# Altium schematic sheet Connectors.SchDoc
size A4; SheetNumber: 4; SheetTotal: 7
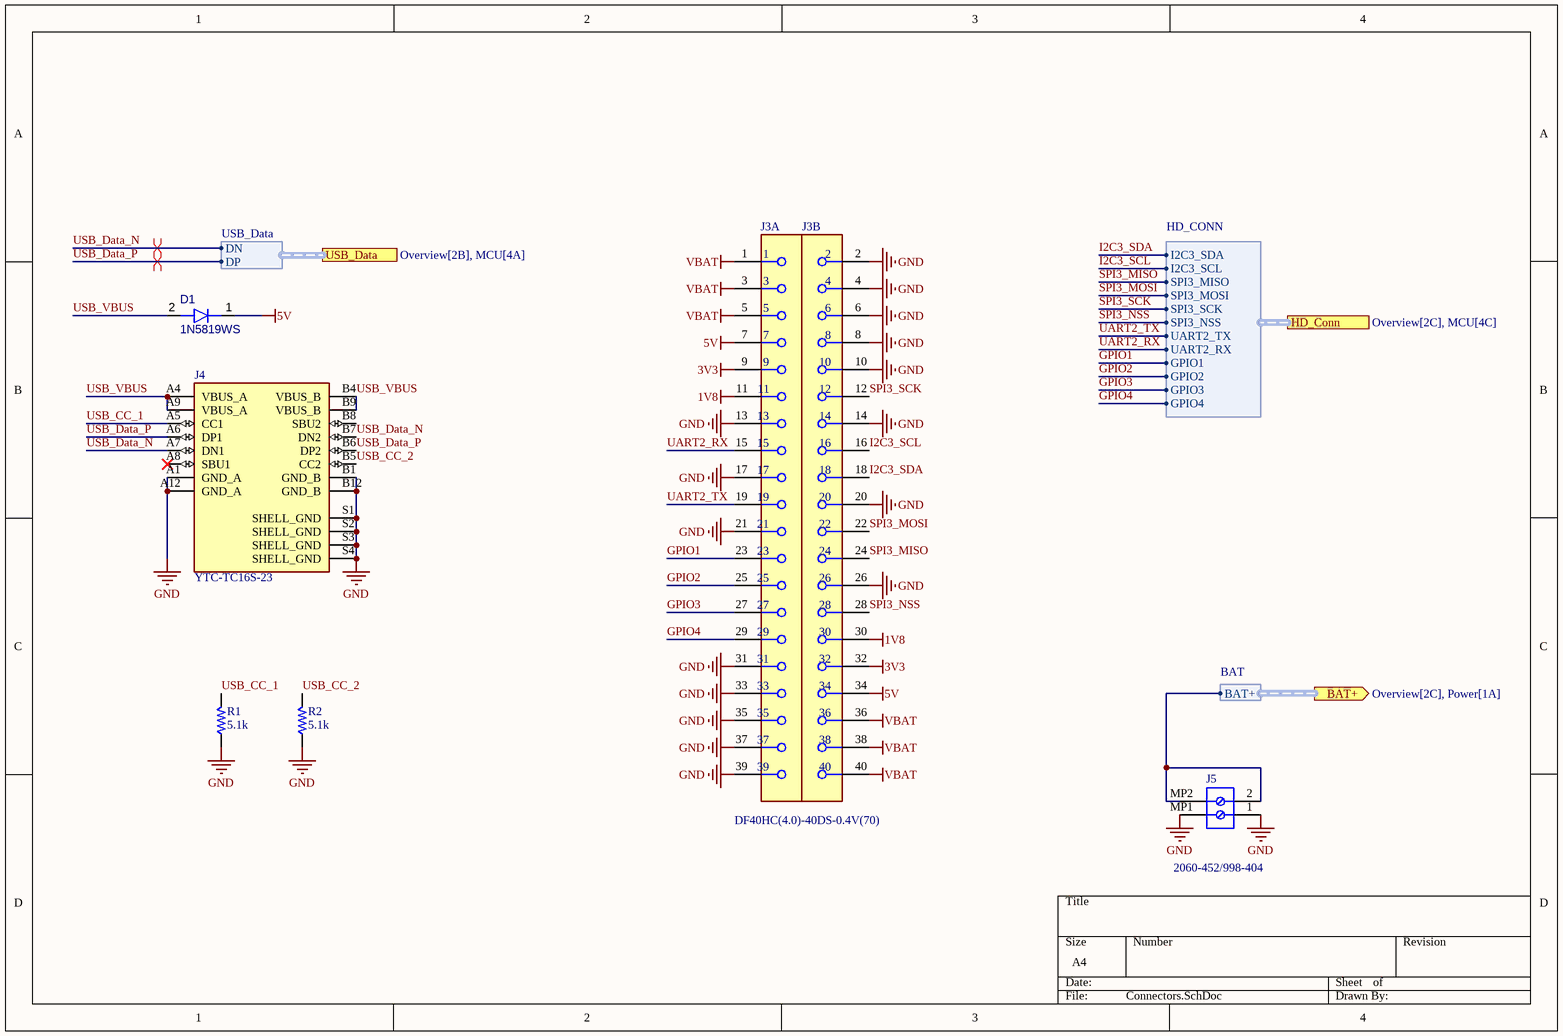
[diagram p0: Connectors.SchDoc]

## Parts
D1  1N5819WS  [FP-477-02-IPC_C]
J3  DF40HC(4.0)-40DS-0.4V(70)  [FP-DF40HC_4_0_-40DS-0_4V-MFG]  (parts A,B of 2)
J4  YTC-TC16S-23  [VALCON_CSP-USC16-TR]
J5  2060-452/998-404  [WAGO-2060-452_V]
R1  value 5.1k  [RES-0402]  (hidden comment: 0402WGF5101TCE)
R2  value 5.1k  [RES-0402]  (hidden comment: 0402WGF5101TCE)

## Ports
BAT+ (out, harness BAT, see Overview[2C], Power[1A]), HD_Conn (harness HD_CONN, see Overview[2C], MCU[4C]), USB_Data (harness USB_Data, see Overview[2B], MCU[4A])

## Harnesses
USB_Data: DP, DN
BAT: BAT+
HD_CONN: I2C3_SDA, I2C3_SCL, SPI3_MISO, SPI3_MOSI, SPI3_SCK, SPI3_NSS, UART2_TX, UART2_RX, GPIO1, GPIO2, GPIO3, GPIO4

## Nets
1V8: J3.11 J3.30
3V3: J3.9 J3.32
5V: D1.1(K) J3.7 J3.34
GND: J3.2 J3.4 J3.6 J3.8 J3.10 J3.13 J3.14 J3.17 J3.20 J3.21 J3.26 J3.31 J3.33 J3.35 J3.37 J3.39 J4.A1(GND_A) J4.A12(GND_A) J4.B1(GND_B) J4.B12(GND_B) J4.S1(SHELL_GND) J4.S2(SHELL_GND) J4.S3(SHELL_GND) J4.S4(SHELL_GND) J5.1 J5.MP1 R1.1 R2.1
VBAT: J3.1 J3.3 J3.5 J3.36 J3.38 J3.40
GPIO1: J3.23 ; port HD_Conn.GPIO1
GPIO2: J3.25 ; port HD_Conn.GPIO2
GPIO3: J3.27 ; port HD_Conn.GPIO3
GPIO4: J3.29 ; port HD_Conn.GPIO4
I2C3_SCL: J3.16 ; port HD_Conn.I2C3_SCL
I2C3_SDA: J3.18 ; port HD_Conn.I2C3_SDA
SPI3_MISO: J3.24 ; port HD_Conn.SPI3_MISO
SPI3_MOSI: J3.22 ; port HD_Conn.SPI3_MOSI
SPI3_NSS: J3.28 ; port HD_Conn.SPI3_NSS
SPI3_SCK: J3.12 ; port HD_Conn.SPI3_SCK
UART2_RX: J3.15 ; port HD_Conn.UART2_RX
UART2_TX: J3.19 ; port HD_Conn.UART2_TX
USB_CC_1: J4.A5(CC1) R1.2
USB_CC_2: J4.B5(CC2) R2.2
USB_Data_N: J4.A7(DN1) J4.B7(DN2) ; port USB_Data.DN
USB_Data_P: J4.A6(DP1) J4.B6(DP2) ; port USB_Data.DP
USB_VBUS: D1.2(A) J4.A4(VBUS_A) J4.A9(VBUS_A) J4.B4(VBUS_B) J4.B9(VBUS_B)
NetJ5_2: J5.2 J5.MP2 ; port BAT+.BAT+

Not connected (* = marked no-connect by the designer): J4 A8(SBU1)* B8(SBU2)

## Layout directives
differential pair: USB_Data_N, USB_Data_P

## Library data of the parts
D1 = CMP-004-00036-1: 40V 600mV@1A 1A SOD-323  Schottky Barrier Diodes (SBD) ROHS; JLCPCB Part Number: C191023
J3 = CMP-002-00094-1: FFC/FPC Connector, 40 Contact(s), 2 Row(s), Female, Straight, 0.016 inch Pitch, Surface Mount Terminal, Locking, Black Insulator, Plug; Connector Type: CARD EDGE CONNECTOR; Mounting Technology: Board; Max Operating Temperature: 85°C; JLCPCB Part Number: C3654058; RoHS Compliant: Yes; Min Operating Temperature: -35°C; System: Connector
J4 = CMP-042-000000-3: YTC-TC16S-23 USB Type C Surface Mount PCB Socket 3A; MP: CSP-USC16-TR; Pin Count: 20; Availability: In Stock; Design Item ID: CSP-USC16-TR; LCSC Part #: C2927300; JLCPCB Part Number: C2927300
J5 = CMP-002-00097-1: Barrier Strip Terminal Block, 9A, 0.75mm2, 1 Row(s), 1 Deck(s); Voltage Rating: 250V; JLCPCB Part Number: C2765055; RoHS Compliant: Yes; Mounting Technology: Board
R1 R2 = CMP-009-00235-1: Resistor, 5.1kΩ, ±1%, 62.5mW, 50V, ±100ppm/℃, -55℃~+155℃, SMD 0402; Manufacturer: Uniroyal; Temperature Coefficient: ±100ppm/℃; ComponentLink1URL: https://datasheet.lcsc.com/lcsc/2206010045_UNI-ROYAL-Uniroyal-Elec-0402WGF5101TCE_C25905.pdf; Design Item ID: 0402WGF5101TCE; JLCPCB Basic Part: Yes; Category: Resistors; Tolerance: 1%; Power Rating: 62.5mW; Voltage Rating: 50V; JLCPCB Part Number: C25905; Case/Package: 0402; Temperature Rating: -55℃~+155℃; Source: jlcpcb_resistors_basic.schlib; Manufacturer Part Number: 0402WGF5101TCE; ComponentLink1Description: Datasheet; ComponentLink2Description: JLCPCB Part URL; ComponentLink2URL: https://jlcpcb.com/partdetail/C25905